# Altium schematic sheet EVENTCTRL_DSP.SchDoc: DSP
size A3; Author: ZLY; DocumentNumber: 9321-E-1102-EMRT EVENT CONTROLLER ACQ; Revision: 1.0; SheetNumber: 5; SheetTotal: 6
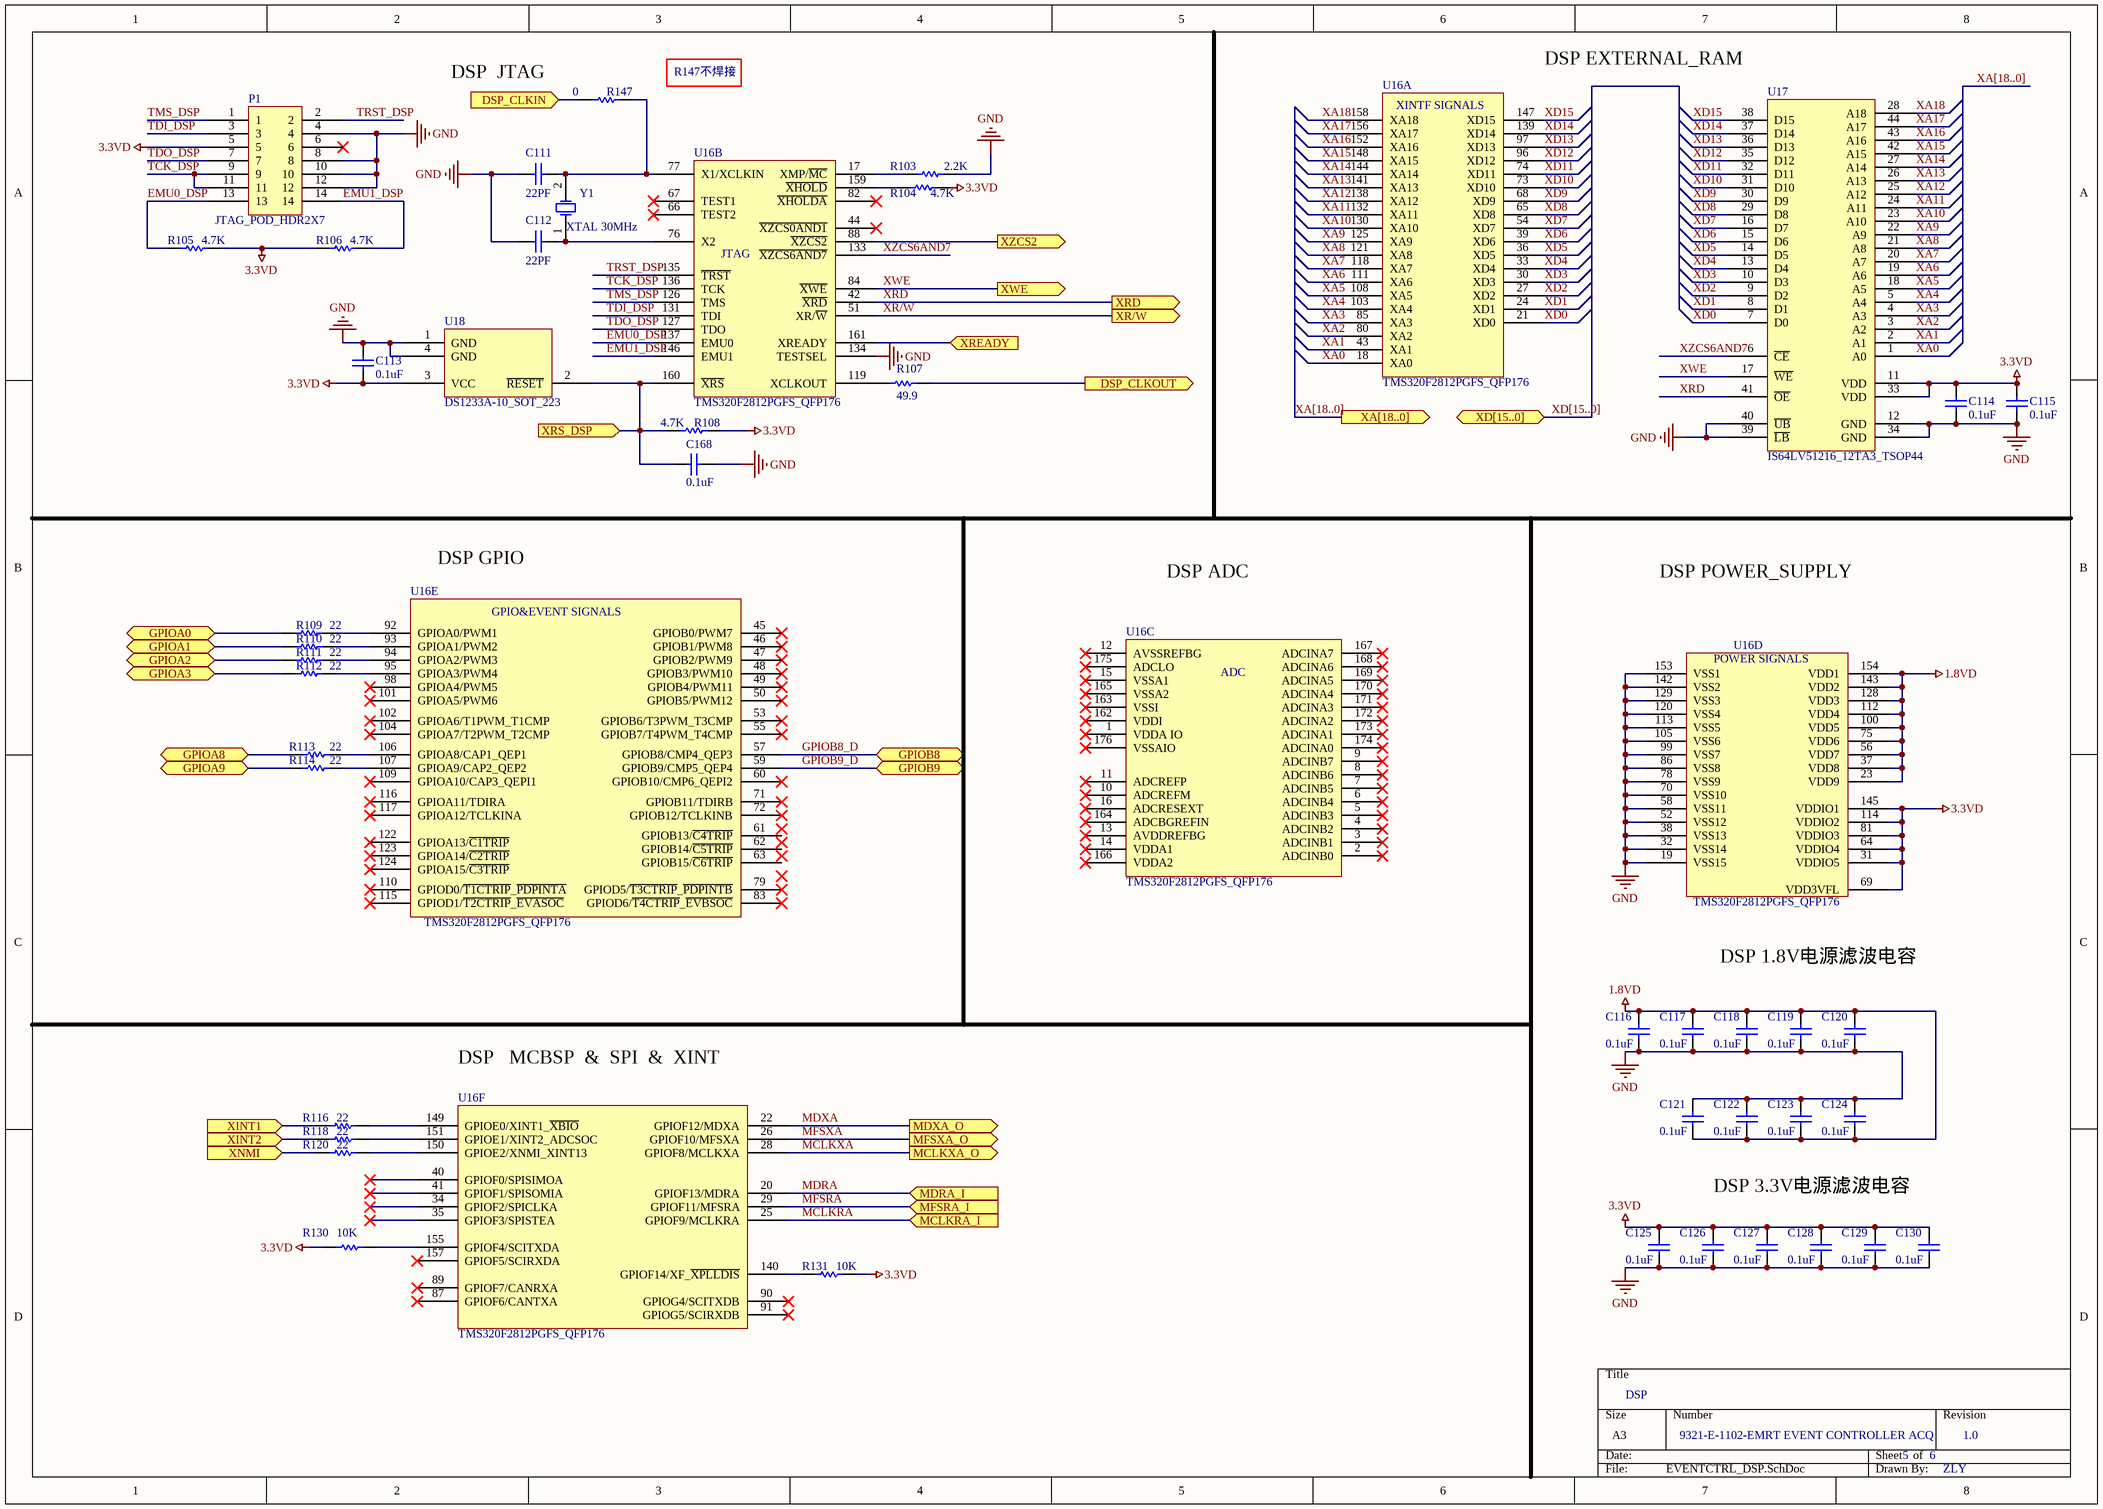
[diagram p0: EVENTCTRL_DSP.SchDoc]

## Parts
C111  value 22PF  [0805]  (hidden comment: C0805)
C112  value 22PF  [0805]  (hidden comment: C0805)
C113  value 0.1uF  [0805]  (hidden comment: C0805)
C114  value 0.1uF  [0805]  (hidden comment: C0805)
C115  value 0.1uF  [0805]  (hidden comment: C0805)
C116  value 0.1uF  [0805]  (hidden comment: C0805)
C117  value 0.1uF  [0805]  (hidden comment: C0805)
C118  value 0.1uF  [0805]  (hidden comment: C0805)
C119  value 0.1uF  [0805]  (hidden comment: C0805)
C120  value 0.1uF  [0805]  (hidden comment: C0805)
C121  value 0.1uF  [0805]  (hidden comment: C0805)
C122  value 0.1uF  [0805]  (hidden comment: C0805)
C123  value 0.1uF  [0805]  (hidden comment: C0805)
C124  value 0.1uF  [0805]  (hidden comment: C0805)
C125  value 0.1uF  [0805]  (hidden comment: C0805)
C126  value 0.1uF  [0805]  (hidden comment: C0805)
C127  value 0.1uF  [0805]  (hidden comment: C0805)
C128  value 0.1uF  [0805]  (hidden comment: C0805)
C129  value 0.1uF  [0805]  (hidden comment: C0805)
C130  value 0.1uF  [0805]  (hidden comment: C0805)
C168  value 0.1uF  [0805]  (hidden comment: C0805)
P1  JTAG_POD_HDR2X7  [HDR2X7]
R103  value 2.2K  [R0805]  (hidden comment: R0805)
R104  value 4.7K  [R0805]  (hidden comment: R0805)
R105  value 4.7K  [R0805]  (hidden comment: R0805)
R106  value 4.7K  [R0805]  (hidden comment: R0805)
R107  value 49.9  [R0805]  (hidden comment: R0805)
R108  value 4.7K  [R0805]  (hidden comment: R0805)
R109  value 22  [R0805]  (hidden comment: R0805)
R110  value 22  [R0805]  (hidden comment: R0805)
R111  value 22  [R0805]  (hidden comment: R0805)
R112  value 22  [R0805]  (hidden comment: R0805)
R113  value 22  [R0805]  (hidden comment: R0805)
R114  value 22  [R0805]  (hidden comment: R0805)
R116  value 22  [R0805]  (hidden comment: R0805)
R118  value 22  [R0805]  (hidden comment: R0805)
R120  value 22  [R0805]  (hidden comment: R0805)
R130  value 10K  [R0805]  (hidden comment: R0805)
R131  value 10K  [R0805]  (hidden comment: R0805)
R147  value 0  [R0805]  (hidden comment: R0805)
U16  TMS320F2812PGFS_QFP176  [QFP176]  (parts A,B,C,D,E,F of 6)
U17  IS64LV51216_12TA3_TSOP44  [TSOP44]
U18  DS1233A-10_SOT_223  [SOT-223]
Y1  XTAL 30MHz  [R38]

## Ports
DSP_CLKIN (in), DSP_CLKOUT (out), GPIOA0 (bidir), GPIOA1 (bidir), GPIOA2 (bidir), GPIOA3 (bidir), GPIOA8 (bidir), GPIOA9 (bidir), GPIOB8 (bidir), GPIOB9 (bidir), MCLKRA_I (in), MCLKXA_O (out), MDRA_I (in), MDXA_O (out), MFSRA_I (in), MFSXA_O (out), XA[18..0] (out), XD[15..0] (bidir), XINT1 (in), XINT2 (in), XNMI (in), XR/W (out), XRD (out), XREADY (in), XRS_DSP (in), XWE (out), XZCS2 (out)

## Nets
1.8VD: C116.1 C117.1 C118.1 C119.1 C120.1 C121.2 C122.2 C123.2 C124.2 U16.23(VDD9) U16.37(VDD8) U16.56(VDD7) U16.75(VDD6) U16.100(VDD5) U16.112(VDD4) U16.128(VDD3) U16.143(VDD2) U16.154(VDD1)
3.3VD: C113.1 C114.2 C115.2 C125.1 C126.1 C127.1 C128.1 C129.1 C130.1 P1.5 R104.1 R105.2 R106.1 R108.1 R130.1 R131.1 U16.31(VDDIO5) U16.64(VDDIO4) U16.69(VDD3VFL) U16.81(VDDIO3) U16.114(VDDIO2) U16.145(VDDIO1) U17.11(VDD) U17.33(VDD) U18.3(VCC)
GND: C111.1 C112.1 C113.2 C114.1 C115.1 C116.2 C117.2 C118.2 C119.2 C120.2 C121.1 C122.1 C123.1 C124.1 C125.2 C126.2 C127.2 C128.2 C129.2 C130.2 C168.2 P1.4 P1.8 P1.10 P1.12 R103.1 U16.19(VSS15) U16.32(VSS14) U16.38(VSS13) U16.52(VSS12) U16.58(VSS11) U16.70(VSS10) U16.78(VSS9) U16.86(VSS8) U16.99(VSS7) U16.105(VSS6) U16.113(VSS5) U16.120(VSS4) U16.129(VSS3) U16.134(TESTSEL) U16.142(VSS2) U16.153(VSS1) U17.12(GND) U17.34(GND) U17.39(~{LB}) U17.40(~{UB}) U18.1(GND) U18.4(GND)
DSP_CLKIN: R147.2 ; port DSP_CLKIN
DSP_CLKOUT: R107.1 ; port DSP_CLKOUT
EMU0_DSP: P1.13 R105.1 U16.137(EMU0)
EMU1_DSP: P1.14 R106.2 U16.146(EMU1)
GPIOA0: R109.1 ; port GPIOA0
GPIOA1: R110.1 ; port GPIOA1
GPIOA2: R111.1 ; port GPIOA2
GPIOA3: R112.1 ; port GPIOA3
GPIOA8: R113.1 ; port GPIOA8
GPIOA9: R114.1 ; port GPIOA9
GPIOB8_D: U16.57(GPIOB8/CMP4_QEP3) ; port GPIOB8
GPIOB9_D: U16.59(GPIOB9/CMP5_QEP4) ; port GPIOB9
MCLKRA: U16.25(GPIOF9/MCLKRA) ; port MCLKRA_I
MCLKXA: U16.28(GPIOF8/MCLKXA) ; port MCLKXA_O
MDRA: U16.20(GPIOF13/MDRA) ; port MDRA_I
MDXA: U16.22(GPIOF12/MDXA) ; port MDXA_O
MFSRA: U16.29(GPIOF11/MFSRA) ; port MFSRA_I
MFSXA: U16.26(GPIOF10/MFSXA) ; port MFSXA_O
TCK_DSP: P1.9 P1.11 U16.136(TCK)
TDI_DSP: P1.3 U16.131(TDI)
TDO_DSP: P1.7 U16.127(TDO)
TMS_DSP: P1.1 U16.126(TMS)
TRST_DSP: P1.2 U16.135(~{TRST})
XA0: U16.18(XA0) U17.1(A0)
XA1: U16.43(XA1) U17.2(A1)
XA2: U16.80(XA2) U17.3(A2)
XA3: U16.85(XA3) U17.4(A3)
XA4: U16.103(XA4) U17.5(A4)
XA5: U16.108(XA5) U17.18(A5)
XA6: U16.111(XA6) U17.19(A6)
XA7: U16.118(XA7) U17.20(A7)
XA8: U16.121(XA8) U17.21(A8)
XA9: U16.125(XA9) U17.22(A9)
XA10: U16.130(XA10) U17.23(A10)
XA11: U16.132(XA11) U17.24(A11)
XA12: U16.138(XA12) U17.25(A12)
XA13: U16.141(XA13) U17.26(A13)
XA14: U16.144(XA14) U17.27(A14)
XA15: U16.148(XA15) U17.42(A15)
XA16: U16.152(XA16) U17.43(A16)
XA17: U16.156(XA17) U17.44(A17)
XA18: U16.158(XA18) U17.28(A18)
XD0: U16.21(XD0) U17.7(D0)
XD1: U16.24(XD1) U17.8(D1)
XD2: U16.27(XD2) U17.9(D2)
XD3: U16.30(XD3) U17.10(D3)
XD4: U16.33(XD4) U17.13(D4)
XD5: U16.36(XD5) U17.14(D5)
XD6: U16.39(XD6) U17.15(D6)
XD7: U16.54(XD7) U17.16(D7)
XD8: U16.65(XD8) U17.29(D8)
XD9: U16.68(XD9) U17.30(D9)
XD10: U16.73(XD10) U17.31(D10)
XD11: U16.74(XD11) U17.32(D11)
XD12: U16.96(XD12) U17.35(D12)
XD13: U16.97(XD13) U17.36(D13)
XD14: U16.139(XD14) U17.37(D14)
XD15: U16.147(XD15) U17.38(D15)
XINT1: R116.1 ; port XINT1
XINT2: R118.1 ; port XINT2
XNMI: R120.1 ; port XNMI
XR/W: U16.51(XR/~{W}) ; port XR/W
XRD: U16.42(~{XRD}) U17.41(~{OE}) ; port XRD
XREADY: U16.161(XREADY) ; port XREADY
XRS_DSP: C168.1 R108.2 U16.160(~{XRS}) U18.2(~{RESET}) ; port XRS_DSP
XWE: U16.84(~{XWE}) U17.17(~{WE}) ; port XWE
XZCS2: U16.88(~{XZCS2}) ; port XZCS2
XZCS6AND7: U16.133(~{XZCS6AND7}) U17.6(~{CE})
NetC111_2: C111.2 R147.1 U16.77(X1/XCLKIN) Y1.2(OSC2)
NetC112_2: C112.2 U16.76(X2) Y1.1(OSC1)
NetR103_2: R103.2 U16.17(XMP/~{MC})
NetR104_2: R104.2 U16.159(~{XHOLD})
NetR107_2: R107.2 U16.119(XCLKOUT)
NetR109_2: R109.2 U16.92(GPIOA0/PWM1)
NetR110_2: R110.2 U16.93(GPIOA1/PWM2)
NetR111_2: R111.2 U16.94(GPIOA2/PWM3)
NetR112_2: R112.2 U16.95(GPIOA3/PWM4)
NetR113_2: R113.2 U16.106(GPIOA8/CAP1_QEP1)
NetR114_2: R114.2 U16.107(GPIOA9/CAP2_QEP2)
NetR116_2: R116.2 U16.149(GPIOE0/XINT1_~{XBIO})
NetR118_2: R118.2 U16.151(GPIOE1/XINT2_ADCSOC)
NetR120_2: R120.2 U16.150(GPIOE2/XNMI_XINT13)
NetR130_2: R130.2 U16.155(GPIOF4/SCITXDA)
NetR131_2: R131.2 U16.140(GPIOF14/XF_~{XPLLDIS})

Not connected (* = marked no-connect by the designer): P1 6*; U16 1(VDDA_IO)* 2(ADCINB0)* 3(ADCINB1)* 4(ADCINB2)* 5(ADCINB3)* 6(ADCINB4)* 7(ADCINB5)* 8(ADCINB6)* 9(ADCINB7)* 10(ADCREFM)* 11(ADCREFP)* 12(AVSSREFBG)* 13(AVDDREFBG)* 14(VDDA1)* 15(VSSA1)* 16(ADCRESEXT)* 34(GPIOF2/SPICLKA)* 35(GPIOF3/SPISTEA)* 40(GPIOF0/SPISIMOA)* 41(GPIOF1/SPISOMIA)* 44(~{XZCS0AND1})* 45(GPIOB0/PWM7)* 46(GPIOB1/PWM8)* 47(GPIOB2/PWM9)* 48(GPIOB3/PWM10)* 49(GPIOB4/PWM11)* 50(GPIOB5/PWM12)* 53(GPIOB6/T3PWM_T3CMP)* 55(GPIOB7/T4PWM_T4CMP)* 60(GPIOB10/CMP6_QEPI2)* 61(GPIOB13/~{C4TRIP}) 62(GPIOB14/~{C5TRIP}) 63(GPIOB15/~{C6TRIP}) 66(TEST2)* 67(TEST1)* 71(GPIOB11/TDIRB)* 72(GPIOB12/TCLKINB)* 79(GPIOD5/~{T3CTRIP}_~{PDPINTB})* 82(~{XHOLDA})* 83(GPIOD6/~{T4CTRIP}_~{EVBSOC})* 87(GPIOF6/CANTXA)* 89(GPIOF7/CANRXA)* 90(GPIOG4/SCITXDB)* 91(GPIOG5/SCIRXDB)* 98(GPIOA4/PWM5)* 101(GPIOA5/PWM6)* 102(GPIOA6/T1PWM_T1CMP)* 104(GPIOA7/T2PWM_T2CMP)* 109(GPIOA10/CAP3_QEPI1)* 110(GPIOD0/~{T1CTRIP}_~{PDPINTA})* 115(GPIOD1/~{T2CTRIP}_~{EVASOC})* 116(GPIOA11/TDIRA)* 117(GPIOA12/TCLKINA)* 122(GPIOA13/~{C1TRIP})* 123(GPIOA14/~{C2TRIP})* 124(GPIOA15/~{C3TRIP})* 157(GPIOF5/SCIRXDA)* 162(VDDI)* 163(VSSI)* 164(ADCBGREFIN)* 165(VSSA2)* 166(VDDA2)* 167(ADCINA7)* 168(ADCINA6)* 169(ADCINA5)* 170(ADCINA4)* 171(ADCINA3)* 172(ADCINA2)* 173(ADCINA1)* 174(ADCINA0)* 175(ADCLO)* 176(VSSAIO)*

## Buses and harness runs
bus XA[18..0]
bus XA[18..0] = port XA[18..0]
bus XD[15..0] = port XD[15..0]

## Notes on the sheet
- (near R147) DSP  JTAG
- R147不焊接
- DSP EXTERNAL_RAM
- DSP GPIO
- DSP ADC
- DSP POWER_SUPPLY
- DSP 1.8V电源滤波电容
- DSP   MCBSP  &  SPI  &  XINT
- DSP 3.3V电源滤波电容
- (in symbol TMS320F2812(176PIN), part A) XINTF SIGNALS
- (in symbol TMS320F2812(176PIN), part B) JTAG
- (in symbol TMS320F2812(176PIN), part C) ADC
- (in symbol TMS320F2812(176PIN), part D) POWER SIGNALS
- (in symbol TMS320F2812(176PIN), part E) GPIO&EVENT SIGNALS

## Library data of the parts
C111-C130 C168 = Cap: Capacitor; PackageReference: C0805
P1 = JTAG_POD
R103-R114 R116 R118 R120 R130 R131 R147 = Res1: Resistor
  R103-R108 R113 R114 R116 R118 R120 R130 R131 R147: PackageReference: R0805
  R109-R112: Published: 8-Jun-2000; LatestRevisionDate: 17-Jul-2002; LatestRevisionNote: Re-released for DXP Platform.; PackageReference: AXIAL-0.3; Publisher: Altium Limited
U16 = TMS320F2812(176PIN)
U17 = IS61LV51216
U18 = DS1233AZ-15
Y1 = XTAL: Crystal Oscillator; Published: 8-Jun-2000; LatestRevisionDate: 17-Jul-2002; LatestRevisionNote: Re-released for DXP Platform.; PackageReference: R38; Publisher: Altium Limited